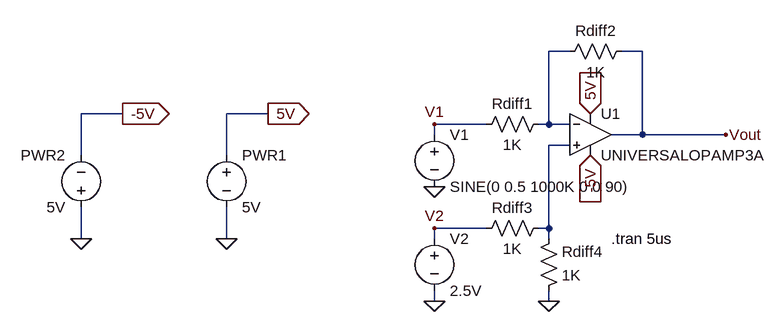
[diagram p0: schematic differential_circuit.asc]
differential_circuit.asc, the LTspice schematic file:
Version 4
SHEET 1 880 952
WIRE 224 240 192 240
WIRE 336 240 304 240
WIRE -464 336 -528 336
WIRE -240 336 -304 336
WIRE 96 352 16 352
WIRE 192 352 192 240
WIRE 192 352 176 352
WIRE 224 352 192 352
WIRE 16 368 16 352
WIRE 336 368 336 240
WIRE 336 368 288 368
WIRE 464 368 336 368
WIRE 224 384 192 384
WIRE -528 400 -528 336
WIRE -304 400 -304 336
WIRE 96 512 16 512
WIRE 192 512 192 384
WIRE 192 512 176 512
WIRE -528 528 -528 480
WIRE -304 528 -304 480
WIRE 16 528 16 512
WIRE 192 528 192 512
WIRE 16 624 16 608
WIRE 192 624 192 608
FLAG -304 528 0
FLAG -240 336 5V
IOPIN -240 336 Out
FLAG -528 528 0
FLAG -464 336 -5V
IOPIN -464 336 Out
FLAG 256 336 5V
IOPIN 256 336 In
FLAG 256 400 -5V
IOPIN 256 400 In
FLAG 16 448 0
FLAG 192 624 0
FLAG 16 624 0
FLAG 464 368 Vout
FLAG 16 512 V2
FLAG 16 352 V1
SYMBOL Voltage -304 384 R0
SYMATTR InstName PWR1
SYMATTR Value 5V
SYMBOL Voltage -528 496 R180
WINDOW 0 24 96 Left 2
WINDOW 3 24 16 Left 2
SYMATTR InstName PWR2
SYMATTR Value 5V
SYMBOL Voltage 16 352 R0
SYMATTR InstName V1
SYMATTR Value SINE(0 0.5 1000K 0 0 90)
SYMBOL Res 192 336 R90
WINDOW 0 0 56 VBottom 2
WINDOW 3 32 56 VTop 2
SYMATTR InstName Rdiff1
SYMATTR Value 1K
SYMBOL Res 320 224 R90
WINDOW 0 0 56 VBottom 2
WINDOW 3 32 56 VTop 2
SYMATTR InstName Rdiff2
SYMATTR Value 1K
SYMBOL OpAmps/UniversalOpAmp3a 256 368 R0
SYMATTR InstName U1
SYMBOL Voltage 16 512 R0
SYMATTR InstName V2
SYMATTR Value 2.5V
SYMBOL Res 192 496 R90
WINDOW 0 0 56 VBottom 2
WINDOW 3 32 56 VTop 2
SYMATTR InstName Rdiff3
SYMATTR Value 1K
SYMBOL Res 176 624 M180
WINDOW 0 36 76 Left 2
WINDOW 3 36 40 Left 2
SYMATTR InstName Rdiff4
SYMATTR Value 1K
TEXT 288 528 Left 2 !.tran 5us

The netlist it stands for:
* differential_circuit.asc
V§PWR1 5V 0 5V
V§PWR2 0 -5V 5V
V1 V1 0 SINE(0 0.5 1000K 0 0 90)
Rdiff1 N001 V1 1K
Rdiff2 Vout N001 1K
XU1 N002 N001 5V -5V Vout level3a Avol=1Meg GBW=10Meg Slew=10Meg Ilimit=25m Rail=0 Vos=0 Phimargin=45 En=0 Enk=0 In=0 Ink=0 Rin=500Meg  ; UNIVERSALOPAMP3A, pins In+ In- V+ V- OUT
V2 V2 0 2.5V
Rdiff3 N002 V2 1K
Rdiff4 0 N002 1K
.tran 5us
.backanno
.end